# Altium schematic sheet shift register pcb.SchDoc
size 431 x 431 mm
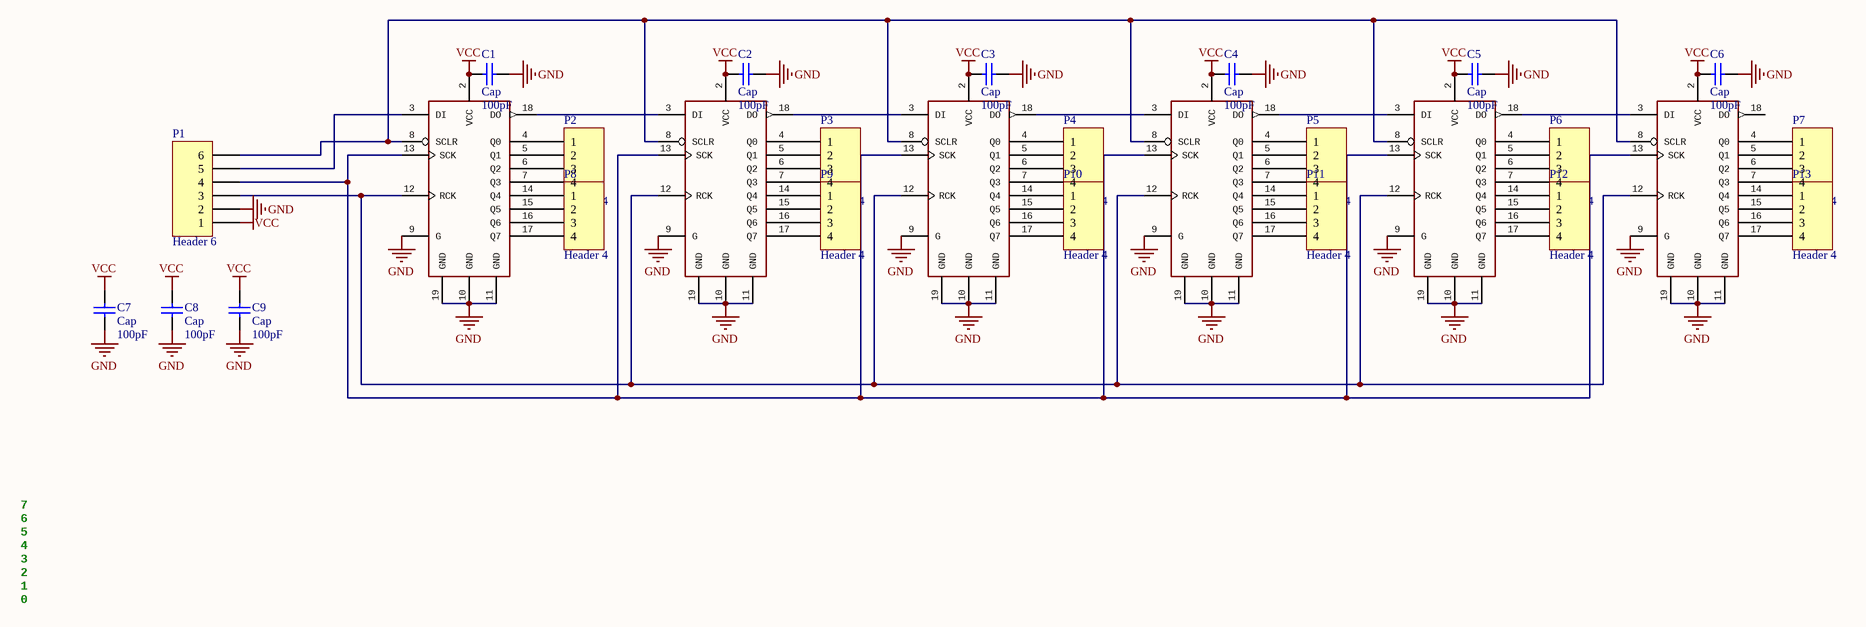
[diagram p0: shift register pcb.SchDoc]

## Parts
C1  Cap  value 100pF  [RAD-0.3]
C2  Cap  value 100pF  [RAD-0.3]
C3  Cap  value 100pF  [RAD-0.3]
C4  Cap  value 100pF  [RAD-0.3]
C5  Cap  value 100pF  [RAD-0.3]
C6  Cap  value 100pF  [RAD-0.3]
C7  Cap  value 100pF  [RAD-0.3]
C8  Cap  value 100pF  [RAD-0.3]
C9  Cap  value 100pF  [RAD-0.3]
IC1  TPIC6B596N  [PDIP20]  (value not drawn)
IC2  TPIC6B596N  [PDIP20]  (value not drawn)
IC3  TPIC6B596N  [PDIP20]  (value not drawn)
IC4  TPIC6B596N  [PDIP20]  (value not drawn)
IC5  TPIC6B596N  [PDIP20]  (value not drawn)
IC6  TPIC6B596N  [PDIP20]  (value not drawn)
P1  Header 6  [HDR1X6]
P2  Header 4  [HDR1X4]
P3  Header 4  [HDR1X4]
P4  Header 4  [HDR1X4]
P5  Header 4  [HDR1X4]
P6  Header 4  [HDR1X4]
P7  Header 4  [HDR1X4]
P8  Header 4  [HDR1X4]
P9  Header 4  [HDR1X4]
P10  Header 4  [HDR1X4]
P11  Header 4  [HDR1X4]
P12  Header 4  [HDR1X4]
P13  Header 4  [HDR1X4]

## Nets
GND: C1.1 C2.1 C3.1 C4.1 C5.1 C6.1 C7.2 C8.2 C9.2 IC1.9(G) IC1.10(GND) IC1.11(GND) IC1.19(GND) IC2.9(G) IC2.10(GND) IC2.11(GND) IC2.19(GND) IC3.9(G) IC3.10(GND) IC3.11(GND) IC3.19(GND) IC4.9(G) IC4.10(GND) IC4.11(GND) IC4.19(GND) IC5.9(G) IC5.10(GND) IC5.11(GND) IC5.19(GND) IC6.9(G) IC6.10(GND) IC6.11(GND) IC6.19(GND) P1.2
VCC: C1.2 C2.2 C3.2 C4.2 C5.2 C6.2 C7.1 C8.1 C9.1 IC1.2(VCC) IC2.2(VCC) IC3.2(VCC) IC4.2(VCC) IC5.2(VCC) IC6.2(VCC) P1.1
NetIC1_3: IC1.3(DI) P1.5
NetIC1_4: IC1.4(Q0) P2.1
NetIC1_5: IC1.5(Q1) P2.2
NetIC1_6: IC1.6(Q2) P2.3
NetIC1_7: IC1.7(Q3) P2.4
NetIC1_8: IC1.8(SCLR) IC2.8(SCLR) IC3.8(SCLR) IC4.8(SCLR) IC5.8(SCLR) IC6.8(SCLR) P1.6
NetIC1_12: IC1.12(RCK) IC2.12(RCK) IC3.12(RCK) IC4.12(RCK) IC5.12(RCK) IC6.12(RCK) P1.3
NetIC1_13: IC1.13(SCK) IC2.13(SCK) IC3.13(SCK) IC4.13(SCK) IC5.13(SCK) IC6.13(SCK) P1.4
NetIC1_14: IC1.14(Q4) P8.1
NetIC1_15: IC1.15(Q5) P8.2
NetIC1_16: IC1.16(Q6) P8.3
NetIC1_17: IC1.17(Q7) P8.4
NetIC1_18: IC1.18(DO) IC2.3(DI)
NetIC2_4: IC2.4(Q0) P3.1
NetIC2_5: IC2.5(Q1) P3.2
NetIC2_6: IC2.6(Q2) P3.3
NetIC2_7: IC2.7(Q3) P3.4
NetIC2_14: IC2.14(Q4) P9.1
NetIC2_15: IC2.15(Q5) P9.2
NetIC2_16: IC2.16(Q6) P9.3
NetIC2_17: IC2.17(Q7) P9.4
NetIC2_18: IC2.18(DO) IC3.3(DI)
NetIC3_4: IC3.4(Q0) P4.1
NetIC3_5: IC3.5(Q1) P4.2
NetIC3_6: IC3.6(Q2) P4.3
NetIC3_7: IC3.7(Q3) P4.4
NetIC3_14: IC3.14(Q4) P10.1
NetIC3_15: IC3.15(Q5) P10.2
NetIC3_16: IC3.16(Q6) P10.3
NetIC3_17: IC3.17(Q7) P10.4
NetIC3_18: IC3.18(DO) IC4.3(DI)
NetIC4_4: IC4.4(Q0) P5.1
NetIC4_5: IC4.5(Q1) P5.2
NetIC4_6: IC4.6(Q2) P5.3
NetIC4_7: IC4.7(Q3) P5.4
NetIC4_14: IC4.14(Q4) P11.1
NetIC4_15: IC4.15(Q5) P11.2
NetIC4_16: IC4.16(Q6) P11.3
NetIC4_17: IC4.17(Q7) P11.4
NetIC4_18: IC4.18(DO) IC5.3(DI)
NetIC5_4: IC5.4(Q0) P6.1
NetIC5_5: IC5.5(Q1) P6.2
NetIC5_6: IC5.6(Q2) P6.3
NetIC5_7: IC5.7(Q3) P6.4
NetIC5_14: IC5.14(Q4) P12.1
NetIC5_15: IC5.15(Q5) P12.2
NetIC5_16: IC5.16(Q6) P12.3
NetIC5_17: IC5.17(Q7) P12.4
NetIC5_18: IC5.18(DO) IC6.3(DI)
NetIC6_4: IC6.4(Q0) P7.1
NetIC6_5: IC6.5(Q1) P7.2
NetIC6_6: IC6.6(Q2) P7.3
NetIC6_7: IC6.7(Q3) P7.4
NetIC6_14: IC6.14(Q4) P13.1
NetIC6_15: IC6.15(Q5) P13.2
NetIC6_16: IC6.16(Q6) P13.3
NetIC6_17: IC6.17(Q7) P13.4

Not connected (* = marked no-connect by the designer): IC6 18(DO)

## Notes on the sheet
- 2
- 3
- 4
- 5
- 6
- 7
- 0
- 1

## Library data of the parts
C1-C9 = Cap: Capacitor; Published: 8-Jun-2000; LatestRevisionDate: 17-Jul-2002; LatestRevisionNote: Re-released for DXP Platform.; PackageReference: RAD-0.3; Publisher: Altium Limited; PackageDescription: Radial Cap, Thru-Hole; 2 Leads; 0.3 in Pin Spacing
P1 = Header 6: Header, 6-Pin; LatestRevisionDate: 17-Jul-2002; LatestRevisionNote: Re-released for DXP Platform.; Publisher: Altium Limited
P2-P13 = Header 4: Header, 4-Pin; LatestRevisionDate: 17-Jul-2002; LatestRevisionNote: Re-released for DXP Platform.; Publisher: Altium Limited